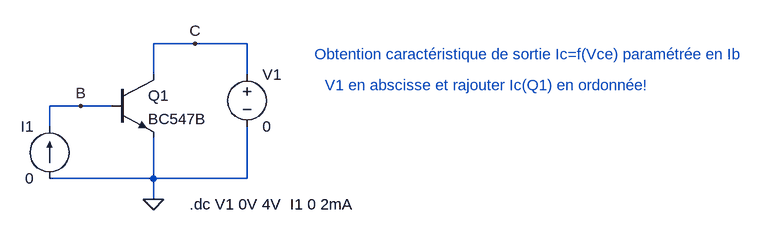
[diagram p0: schematic TraceTransistor.asc]
TraceTransistor.asc, the LTspice schematic file:
Version 4
SHEET 1 1252 680
WIRE 272 32 208 32
WIRE 352 32 272 32
WIRE 208 80 208 32
WIRE 352 80 352 32
WIRE 96 128 48 128
WIRE 144 128 96 128
WIRE 48 160 48 128
WIRE 208 240 208 176
WIRE 208 240 48 240
WIRE 352 240 352 160
WIRE 352 240 208 240
WIRE 208 272 208 240
FLAG 208 272 0
FLAG 272 32 C
FLAG 96 128 B
SYMBOL npn 144 80 R0
SYMATTR InstName Q1
SYMATTR Value BC547B
SYMBOL voltage 352 64 R0
WINDOW 123 0 0 Left 2
WINDOW 39 0 0 Left 2
SYMATTR InstName V1
SYMATTR Value 0
SYMBOL current 48 240 R180
WINDOW 0 24 80 Left 2
WINDOW 3 24 0 Left 2
SYMATTR InstName I1
SYMATTR Value 0
TEXT 264 280 Left 2 !.dc V1 0V 4V  I1 0 2mA 
TEXT 456 48 Left 2 ;Obtention caractéristique de sortie Ic=f(Vce) paramétrée en Ib
TEXT 472 96 Left 2 ;V1 en abscisse et rajouter Ic(Q1) en ordonnée!

The netlist it stands for:
* TraceTransistor.asc
Q1 C B 0 0 BC547B
V1 C 0 0
I1 0 B 0
.model NPN NPN
.model PNP PNP
.lib standard.bjt
.dc V1 0V 4V  I1 0 2mA
* Obtention caractéristique de sortie Ic=f(Vce) paramétrée en Ib
* V1 en abscisse et rajouter Ic(Q1) en ordonnée!
.backanno
.end